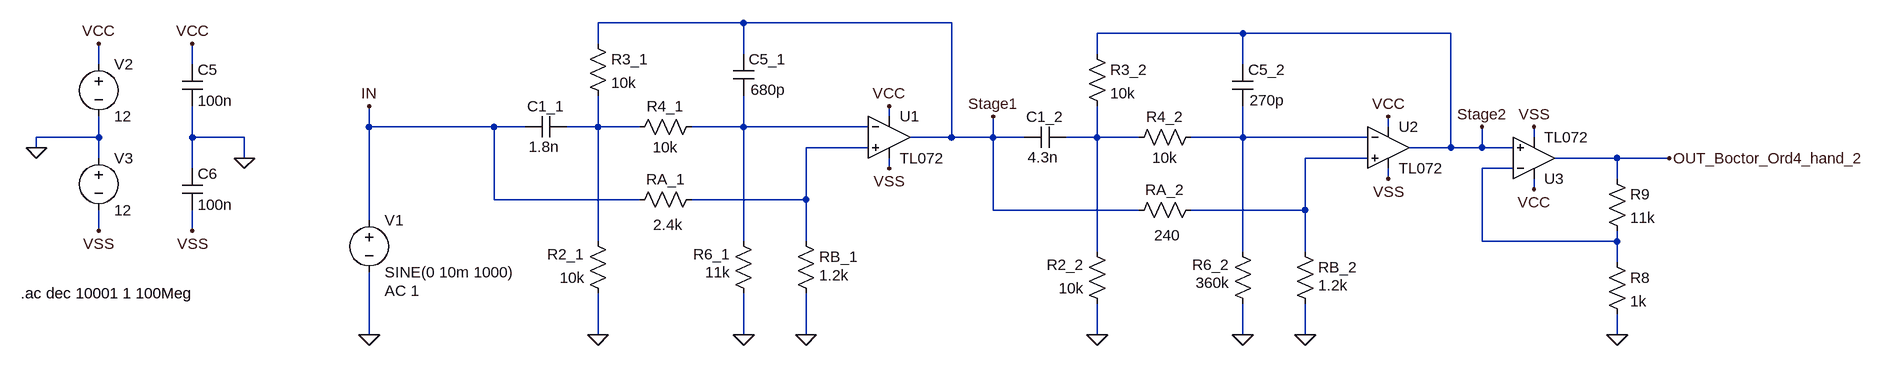
[diagram p0: schematic Boctor_ordnung4_10kHz_1dB_30dB_inv_cheby_händisch2.asc]
Boctor_ordnung4_10kHz_1dB_30dB_inv_cheby_händisch2.asc, the LTspice schematic file:
Version 4
SHEET 1 2660 836
WIRE 384 128 160 128
WIRE 704 128 384 128
WIRE 1152 144 928 144
WIRE 1472 144 1152 144
WIRE 160 160 160 128
WIRE 384 176 384 128
WIRE 928 176 928 144
WIRE -608 192 -608 160
WIRE -464 192 -464 160
WIRE 1152 192 1152 144
WIRE 608 272 608 256
WIRE -192 288 -192 256
WIRE 0 288 -192 288
WIRE 48 288 0 288
WIRE 160 288 160 240
WIRE 160 288 112 288
WIRE 224 288 160 288
WIRE 384 288 384 240
WIRE 384 288 304 288
WIRE 576 288 384 288
WIRE 1376 288 1376 272
WIRE -608 304 -608 272
WIRE -608 304 -704 304
WIRE -464 304 -464 256
WIRE -384 304 -464 304
WIRE 704 304 704 128
WIRE 704 304 640 304
WIRE 768 304 768 272
WIRE 768 304 704 304
WIRE 816 304 768 304
WIRE 928 304 928 256
WIRE 928 304 880 304
WIRE 992 304 928 304
WIRE 1152 304 1152 256
WIRE 1152 304 1072 304
WIRE 1344 304 1152 304
WIRE 1600 304 1600 288
WIRE -704 320 -704 304
WIRE 576 320 480 320
WIRE 1472 320 1472 144
WIRE 1472 320 1408 320
WIRE 1520 320 1520 288
WIRE 1520 320 1472 320
WIRE 1568 320 1520 320
WIRE -608 336 -608 304
WIRE -384 336 -384 304
WIRE 1344 336 1248 336
WIRE 1728 336 1632 336
WIRE 1808 336 1728 336
WIRE -464 352 -464 304
WIRE 608 352 608 336
WIRE 1568 352 1520 352
WIRE 1376 368 1376 352
WIRE 1728 368 1728 336
WIRE 1600 384 1600 368
WIRE 0 400 0 288
WIRE 224 400 0 400
WIRE 480 400 480 320
WIRE 480 400 304 400
WIRE 768 416 768 304
WIRE 992 416 768 416
WIRE 1248 416 1248 336
WIRE 1248 416 1072 416
WIRE -192 432 -192 288
WIRE -608 448 -608 416
WIRE -464 448 -464 416
WIRE 160 464 160 288
WIRE 384 464 384 288
WIRE 480 464 480 400
WIRE 1520 464 1520 352
WIRE 1728 464 1728 448
WIRE 1728 464 1520 464
WIRE 928 480 928 304
WIRE 1152 480 1152 304
WIRE 1248 480 1248 416
WIRE 1728 496 1728 464
WIRE -192 608 -192 512
WIRE 160 608 160 544
WIRE 384 608 384 544
WIRE 480 608 480 544
WIRE 928 608 928 560
WIRE 1152 608 1152 560
WIRE 1248 608 1248 560
WIRE 1728 608 1728 576
FLAG -608 160 VCC
FLAG -608 448 VSS
FLAG -704 320 0
FLAG -464 160 VCC
FLAG -464 448 VSS
FLAG -384 336 0
FLAG -192 608 0
FLAG -192 256 IN
FLAG 608 256 VCC
FLAG 608 352 VSS
FLAG 160 608 0
FLAG 384 608 0
FLAG 480 608 0
FLAG 768 272 Stage1
FLAG 1376 272 VCC
FLAG 1376 368 VSS
FLAG 928 608 0
FLAG 1152 608 0
FLAG 1248 608 0
FLAG 1728 608 0
FLAG 1600 288 VSS
FLAG 1600 384 VCC
FLAG 1808 336 OUT_Boctor_Ord4_hand_2
FLAG 1520 288 Stage2
SYMBOL voltage -192 416 R0
WINDOW 123 24 124 Left 2
WINDOW 39 0 0 Left 0
SYMATTR Value2 AC 1
SYMATTR InstName V1
SYMATTR Value SINE(0 10m 1000)
SYMBOL voltage -608 176 R0
WINDOW 123 0 0 Left 0
WINDOW 39 0 0 Left 0
SYMATTR InstName V2
SYMATTR Value 12
SYMBOL voltage -608 320 R0
WINDOW 123 0 0 Left 0
WINDOW 39 0 0 Left 0
SYMATTR InstName V3
SYMATTR Value 12
SYMBOL cap -480 192 R0
SYMATTR InstName C5
SYMATTR Value 100n
SYMBOL cap -480 352 R0
SYMATTR InstName C6
SYMATTR Value 100n
SYMBOL res 144 144 R0
SYMATTR InstName R3_1
SYMATTR Value 10k
SYMBOL res 320 272 R90
WINDOW 0 0 56 VBottom 2
WINDOW 3 32 56 VTop 2
SYMATTR InstName R4_1
SYMATTR Value 10k
SYMBOL res 400 560 R180
WINDOW 0 36 76 Left 2
WINDOW 3 36 48 Left 2
SYMATTR InstName R6_1
SYMATTR Value 11k
SYMBOL res 176 560 R180
WINDOW 0 36 76 Left 2
WINDOW 3 36 40 Left 2
SYMATTR InstName R2_1
SYMATTR Value 10k
SYMBOL res 208 416 R270
WINDOW 0 32 56 VTop 2
WINDOW 3 -38 60 VTop 2
SYMATTR InstName RA_1
SYMATTR Value 2.4k
SYMBOL res 464 448 R0
WINDOW 3 36 68 Left 2
SYMATTR Value 1.2k
SYMATTR InstName RB_1
SYMBOL cap 368 176 R0
WINDOW 3 27 55 Left 2
SYMATTR Value 680p
SYMATTR InstName C5_1
SYMBOL cap 112 272 R90
WINDOW 0 0 32 VBottom 2
WINDOW 3 62 35 VBottom 2
SYMATTR InstName C1_1
SYMATTR Value 1.8n
SYMBOL TL072 608 240 R0
SYMATTR InstName U1
SYMBOL res 912 160 R0
SYMATTR InstName R3_2
SYMATTR Value 10k
SYMBOL res 1088 288 R90
WINDOW 0 0 56 VBottom 2
WINDOW 3 32 56 VTop 2
SYMATTR InstName R4_2
SYMATTR Value 10k
SYMBOL res 1168 576 R180
WINDOW 0 36 76 Left 2
WINDOW 3 36 48 Left 2
SYMATTR InstName R6_2
SYMATTR Value 360k
SYMBOL res 944 576 R180
WINDOW 0 36 76 Left 2
WINDOW 3 36 40 Left 2
SYMATTR InstName R2_2
SYMATTR Value 10k
SYMBOL res 976 432 R270
WINDOW 0 32 56 VTop 2
WINDOW 3 -38 60 VTop 2
SYMATTR InstName RA_2
SYMATTR Value 240
SYMBOL res 1232 464 R0
WINDOW 3 36 68 Left 2
SYMATTR Value 1.2k
SYMATTR InstName RB_2
SYMBOL cap 1136 192 R0
WINDOW 3 27 55 Left 2
SYMATTR Value 270p
SYMATTR InstName C5_2
SYMBOL cap 880 288 R90
WINDOW 0 0 32 VBottom 2
WINDOW 3 62 35 VBottom 2
SYMATTR InstName C1_2
SYMATTR Value 4.3n
SYMBOL TL072 1376 256 R0
SYMATTR InstName U2
SYMBOL res 1712 480 R0
SYMATTR InstName R8
SYMATTR Value 1k
SYMBOL res 1712 352 R0
SYMATTR InstName R9
SYMATTR Value 11k
SYMBOL TL072 1600 400 M180
SYMATTR InstName U3
TEXT -728 544 Left 2 !.ac dec 10001 1 100Meg

The netlist it stands for:
* Boctor_ordnung4_10kHz_1dB_30dB_inv_cheby_händisch2.asc
V1 IN 0 SINE(0 10m 1000) AC 1
V2 VCC 0 12
V3 0 VSS 12
C5 VCC 0 100n
C6 0 VSS 100n
R3_1 Stage1 N001 10k
R4_1 N002 N001 10k
R6_1 0 N002 11k
R2_1 0 N001 10k
RA_1 IN N005 2.4k
RB_1 N005 0 1.2k
C5_1 Stage1 N002 680p
C1_1 N001 IN 1.8n
* U1: TL072 (symbol TL072 not available, pins judged from their places): In+=N005 In-=N002 V+=VCC V-=VSS OUT=Stage1
R3_2 Stage2 N003 10k
R4_2 N004 N003 10k
R6_2 0 N004 360k
R2_2 0 N003 10k
RA_2 Stage1 N006 240
RB_2 N006 0 1.2k
C5_2 Stage2 N004 270p
C1_2 N003 Stage1 4.3n
* U2: TL072 (symbol TL072 not available, pins judged from their places): In+=N006 In-=N004 V+=VCC V-=VSS OUT=Stage2
R8 N007 0 1k
R9 OUT_Boctor_Ord4_hand_2 N007 11k
* U3: TL072 (symbol TL072 not available, pins judged from their places): In+=Stage2 In-=N007 V+=VCC V-=VSS OUT=OUT_Boctor_Ord4_hand_2
.ac dec 10001 1 100Meg
.backanno
.end